# EasyEDA Pro project KVM Assistant.eprj

# Schematic 3.5mm Input Connector
Board Name: 3.5mm Input Connector; Create Date: 2025-04-06; Page Name: P1; Project Name: KVM Assistant 3; Schematic Name: 3.5mm Input Connector; Update Date: 2025-04-06; Company: EasyEDA.com; Page Size: A4; Version: V1.0
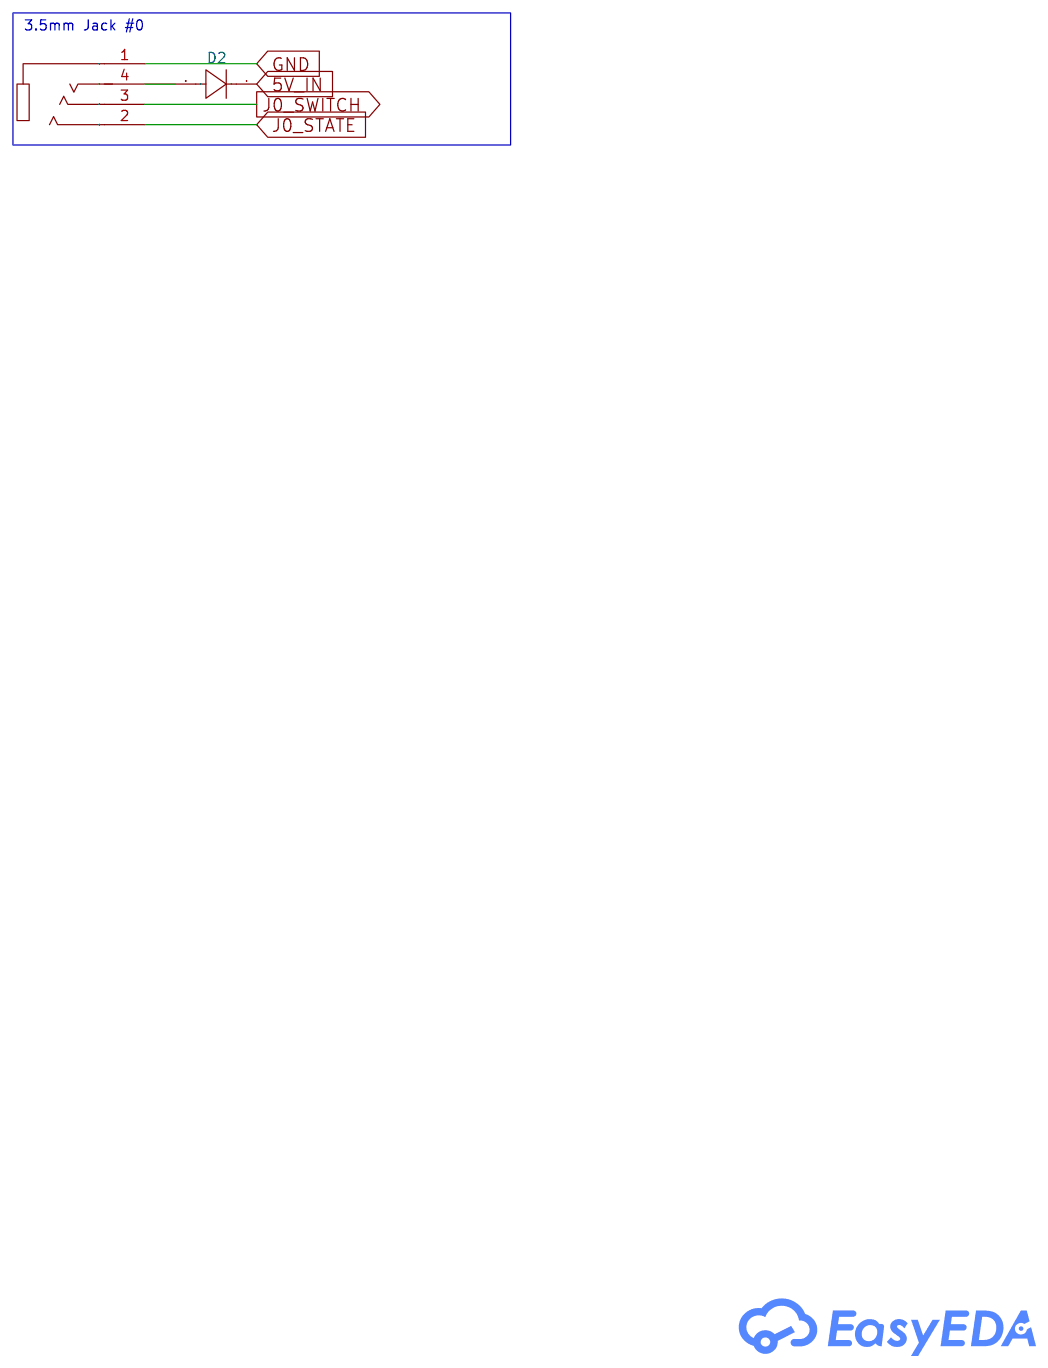
[diagram p0: schematic sheet]

## Parts
3.5mm  PJ-320D  [AUDIO-SMD_PJ-320D]
D2  -  [DO-41_BD2.4-L4.7-P8.70-D0.9-RD]

## Library data of the parts
3.5mm = PJ-320D_C431535: Connector Type:3.5mm Headphone Jack Current Rating (Max):500mA Voltage Rating (Max):50V Contact Material:Copper Contact Plating:Silver Operating Temperature Range:-30℃~+70℃ Operating Temperature Range:-30℃~+70℃; LCSC Part Name: 3.5mm耳机座; Supplier Part: C431535; Manufacturer: SHOU HAN(首韩); Supplier Footprint: SMD; JLCPCB Part Class: Extended Part; Datasheet: https://atta.szlcsc.com/upload/public/pdf/source/20190925/C431535_8B274506621F6117FB020BF07A197848.pdf; Supplier: LCSC; Connector Type: 3.5mm Headphone Jack; Current Rating (Max): 500mA; Voltage Rating (Max): 50V; Contact Material: Copper; Contact Plating: Silver; Operating Temperature Range: -30℃~+70℃; INPUT_NUMBER: 1
D2 = 1N4007: Supplier Footprint: DO-41; INPUT_NUMBER: 1

## Nets
5V_IN: D2.1(K)
GND: 3.5mm.1
J0_STATE: 3.5mm.2
J0_SWITCH: 3.5mm.3
Net-(3.5mm-4): 3.5mm.4 D2.2(A)

## Notes on the sheet
- 3.5mm Jack #0

# Schematic inputs

## Sheets
1 inputs: Board Name: Board1; Create Date: 2025-04-06; Page Name: inputs; Project Name: KVM Assistant 3; Schematic Name: inputs; Update Date: 2025-04-06; File: inputs; Id: /; Sheet: /
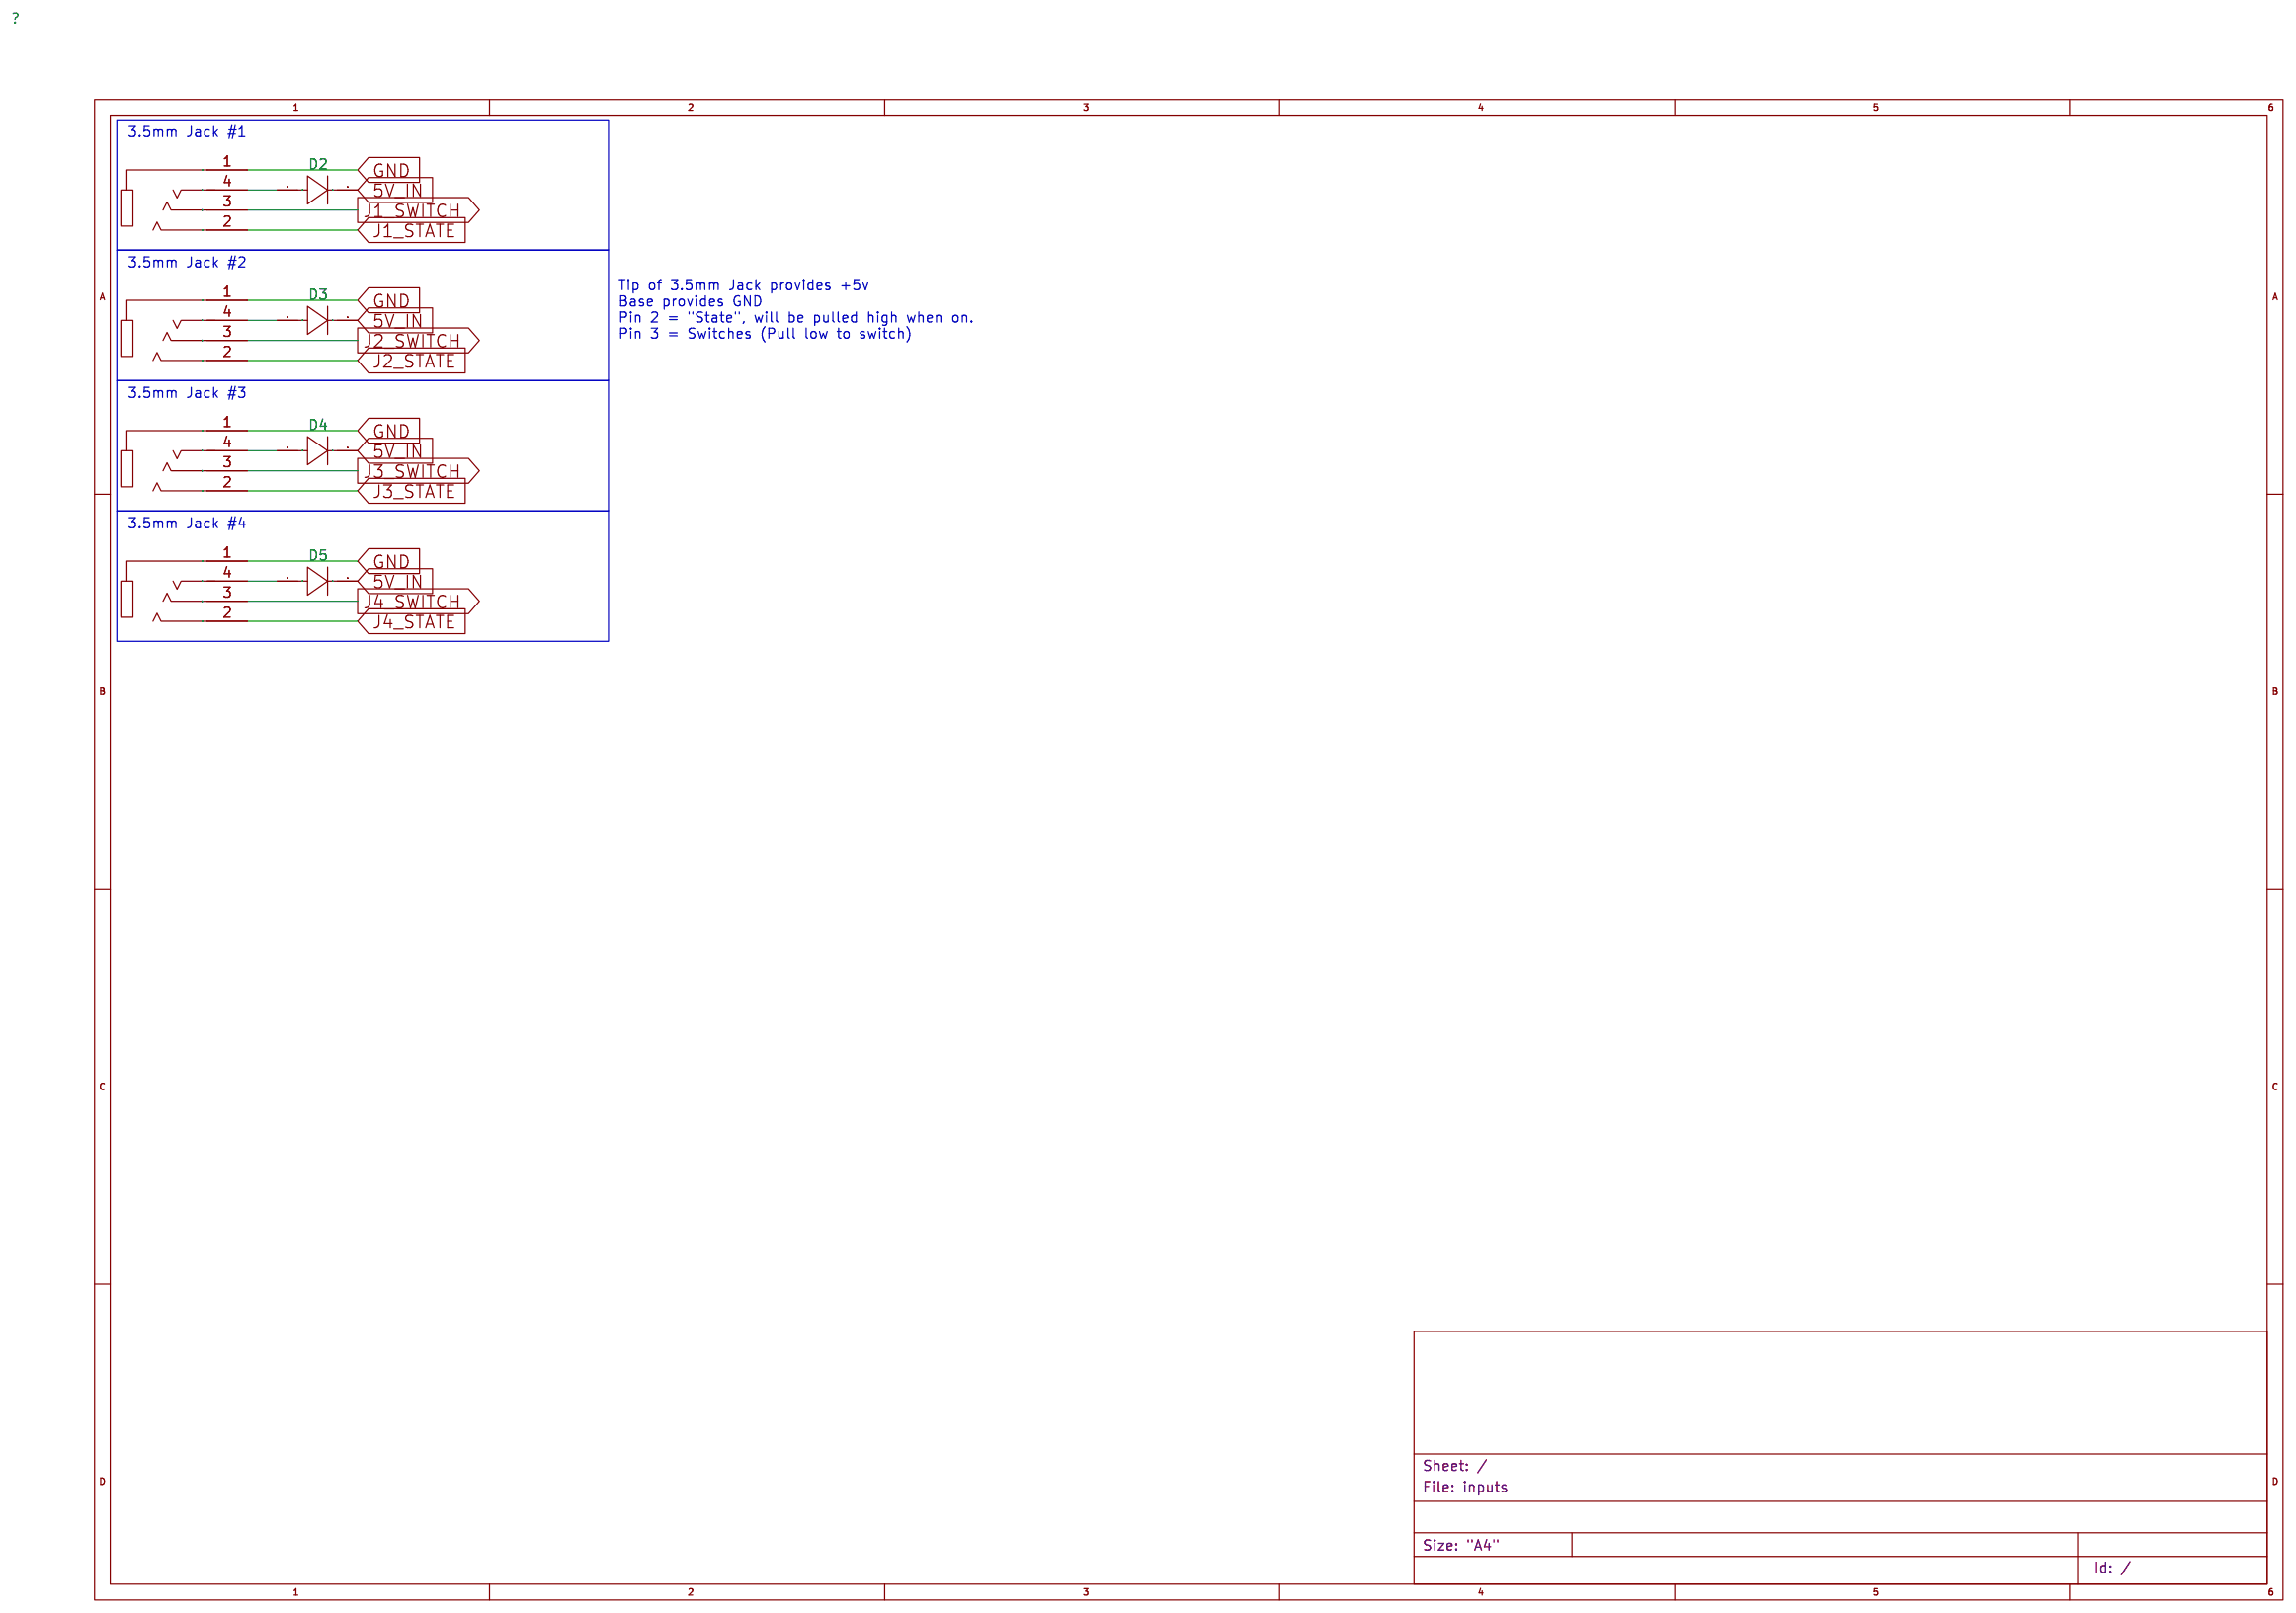
[diagram p1: inputs]
2 logic: Page Name: logic; File: logic
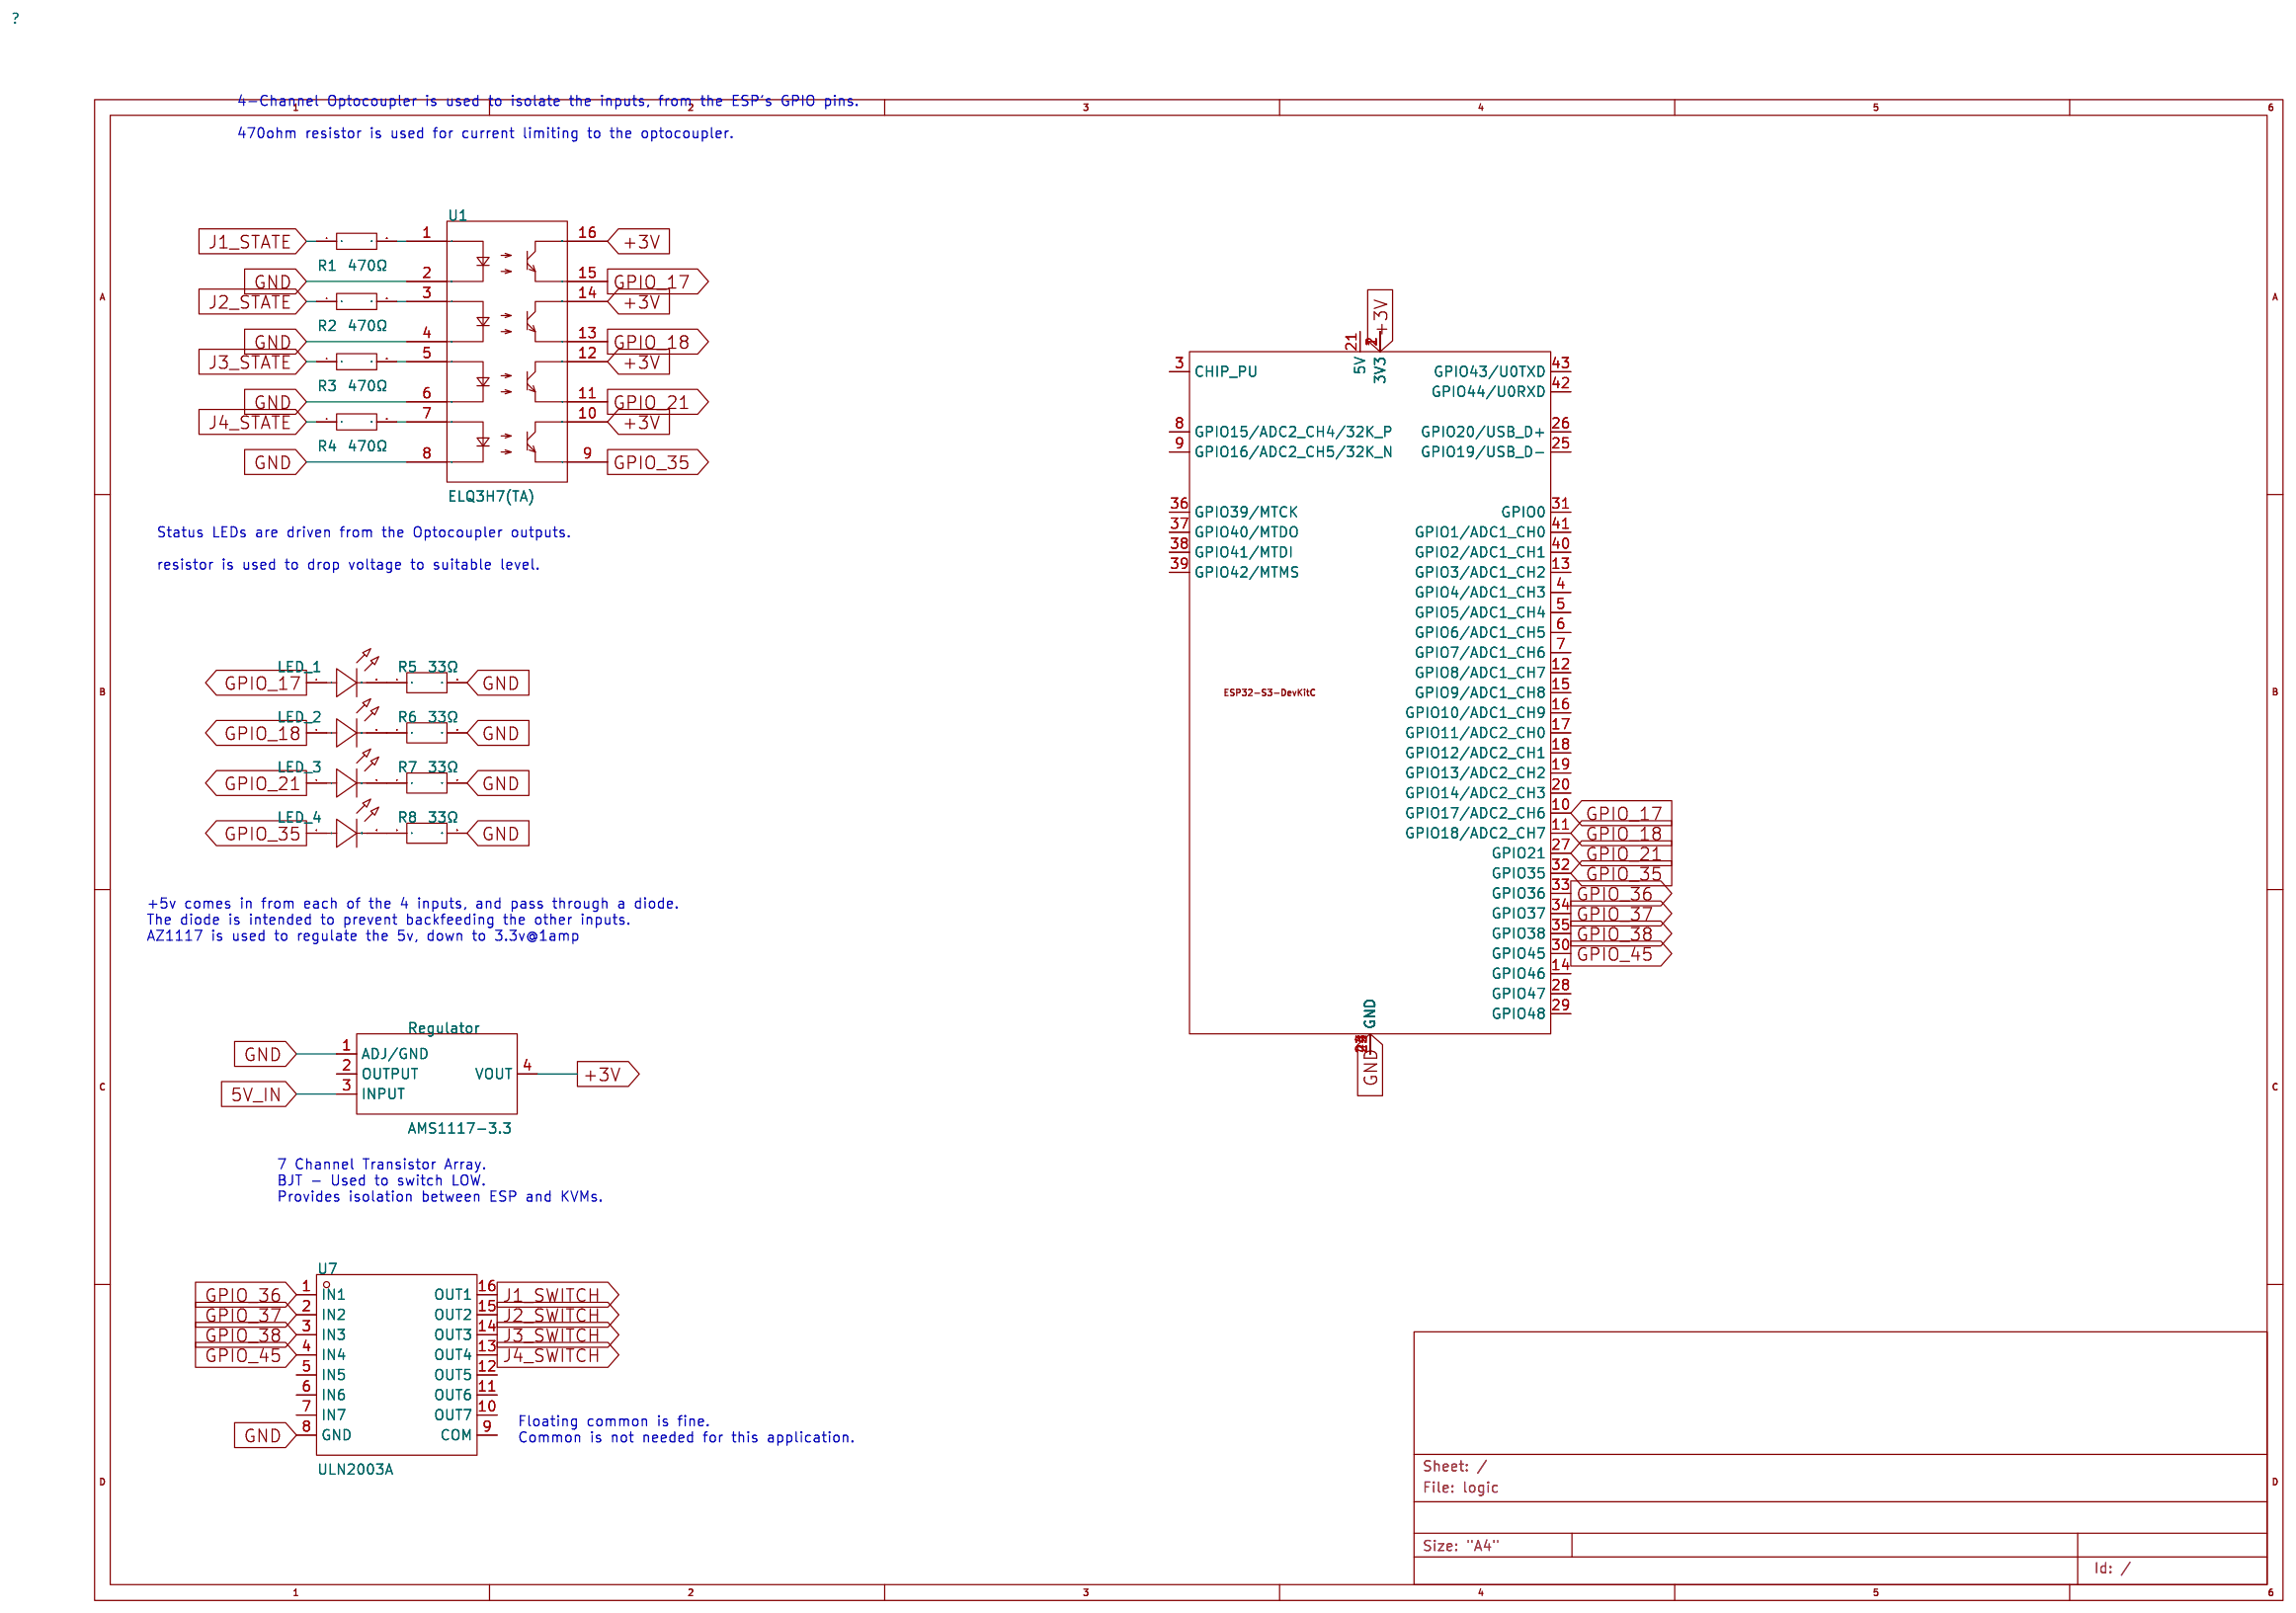
[diagram p2: logic]

## Parts
sheet inputs
3.5mm1  PJ-320D  [AUDIO-SMD_PJ-320D]
3.5mm2  PJ-320D  [AUDIO-SMD_PJ-320D]
3.5mm3  PJ-320D  [AUDIO-SMD_PJ-320D]
3.5mm4  PJ-320D  [AUDIO-SMD_PJ-320D]
D2  -  [DO-41_BD2.4-L4.7-P8.70-D0.9-RD]
D3  -  [DO-41_BD2.4-L4.7-P8.70-D0.9-RD]
D4  -  [DO-41_BD2.4-L4.7-P8.70-D0.9-RD]
D5  -  [DO-41_BD2.4-L4.7-P8.70-D0.9-RD]
sheet logic
ESP  ESP32-S3-DevKitC  [PCM_Espressif:ESP32-S3-DevKitC]
LED_1  DY-332SUGD-A3  [LED-TH_BD5.9-P2.54-FD]
LED_2  DY-332SUGD-A3  [LED-TH_BD5.9-P2.54-FD]
LED_3  DY-332SUGD-A3  [LED-TH_BD5.9-P2.54-FD]
LED_4  DY-332SUGD-A3  [LED-TH_BD5.9-P2.54-FD]
R1  470Ω  [R1206]
R2  470Ω  [R1206]
R3  470Ω  [R1206]
R4  470Ω  [R1206]
R5  33Ω  [R1206]
R6  33Ω  [R1206]
R7  33Ω  [R1206]
R8  33Ω  [R1206]
Regulator  AMS1117-3.3  [SOT-223-3_L6.5-W3.4-P2.30-LS7.0-BR]
U1  ELQ3H7(TA)  [SOP-16_L10.3-W4.4-P1.27-LS7.0-BL]
U7  ULN2003A  [DIP-16_L20.0-W6.4-P2.54-LS7.6-BL]

## Library data of the parts
3.5mm1-3.5mm4 = PJ-320D_C431535: Connector Type:3.5mm Headphone Jack Current Rating (Max):500mA Voltage Rating (Max):50V Contact Material:Copper Contact Plating:Silver Operating Temperature Range:-30℃~+70℃ Operating Temperature Range:-30℃~+70℃; LCSC Part Name: 3.5mm耳机座; Supplier Part: C431535; Manufacturer: SHOU HAN(首韩); Supplier Footprint: SMD; JLCPCB Part Class: Extended Part; Datasheet: https://atta.szlcsc.com/upload/public/pdf/source/20190925/C431535_8B274506621F6117FB020BF07A197848.pdf; Supplier: LCSC; Connector Type: 3.5mm Headphone Jack; Current Rating (Max): 500mA; Voltage Rating (Max): 50V; Contact Material: Copper; Contact Plating: Silver; Operating Temperature Range: -30℃~+70℃; INPUT_NUMBER: 1
D2-D5 = 1N4007: Supplier Footprint: DO-41; INPUT_NUMBER: 1
ESP = PCM_Espressif_ESP32-S3-DevKitC
LED_1-LED_4 = DY-332SUGD-A3: LCSC Part Name: 5mm圆头有边翠绿色; Supplier Part: C7470788; Manufacturer: TONYU(东裕); Supplier Footprint: D=5mm; JLCPCB Part Class: Extended Part; Datasheet: https://atta.szlcsc.com/upload/public/pdf/source/20230726/AA93B767F39ACAA896428125483B3D95.pdf; Supplier: LCSC
R1-R4 = 1206W4F4700T5E: Type:Thick Film Resistors Resistance: Tolerance:±1% Tolerance:±1% Power(Watts): Overload Voltage (Max): Temperature Coefficient:±100ppm/℃ Temperature Coefficient:±100ppm/℃ Operating Temperature Range:-55℃~+155℃ Operating Temperature Range:-55℃~+155℃; LCSC Part Name: 470Ω ±1% 250mW 厚膜电阻; Supplier Part: C4502; Manufacturer: UNI-ROYAL(厚声); Supplier Footprint: 1206; JLCPCB Part Class: Extended Part; Datasheet: https://atta.szlcsc.com/upload/public/pdf/source/20200306/C422600_1E6D84923E4A46A82E41ADD87F860B5C.pdf; Supplier: LCSC; Type: Thick Film Resistors; Tolerance: ±1%; Temperature Coefficient: ±100ppm/℃; Operating Temperature Range: -55℃~+155℃
R5-R8 = FRC1206F33R0TS: Type:Thick Film Resistors Resistance: Tolerance:±1% Tolerance:±1% Power(Watts): Overload Voltage (Max): Temperature Coefficient:±100ppm/℃ Temperature Coefficient:±100ppm/℃ Operating Temperature Range:-55℃~+155℃ Operating Temperature Range:-55℃~+155℃; LCSC Part Name: 33Ω ±1% 250mW 厚膜电阻; Supplier Part: C2907384; Manufacturer: FOJAN(富捷); Supplier Footprint: 1206; JLCPCB Part Class: Extended Part; Datasheet: https://atta.szlcsc.com/upload/public/pdf/source/20211221/925EC7D7225764EE0046F22065062C87.pdf; Supplier: LCSC; Type: Thick Film Resistors; Tolerance: ±1%; Temperature Coefficient: ±100ppm/℃; Operating Temperature Range: -55℃~+155℃
Regulator = AMS1117-3.3_C18212698: Output Type:Fixed Voltage - Supply:18V Output Voltage:3.3V Output Voltage:3.3V Output Current:1A Power Supply Rejection Ratio (PSRR):- Voltage Dropout:- standby current:- Noise:- Features:- Operating Temperature:- Operating Temperature:- Output Configurat; Supplier Part: C18212698; Manufacturer: TECH PUBLIC(台舟); Supplier Footprint: SOT-223; JLCPCB Part Class: Extended Part; Datasheet: https://atta.szlcsc.com/upload/public/pdf/source/20231024/2F46361C191D0B74404CBB3E85314756.pdf; Supplier: LCSC; Output Type: Fixed; Voltage - Supply: 18V; Output Voltage: 3.3V; Output Current: 1A; Maximum Input Voltage: 13V; MAX Output Current: 1A; Dropout Voltage: 1.3V@(1A); Output Polarity: Positive electrode
U1 = ELQ3H7(TA): Input voltage type:DC Output Type:Phototransistor Forward Voltage:1.2V Output Current:50mA Isolation Voltage(rms):3.75kV Reverse Voltage:6V Load Voltage:80V Number of Outputs:4 Collector-Emitter Saturation Voltage (Vce(sat)@Ic,IF):100mV@1mA,10mA Rise time; LCSC Part Name: DC输入 隔离电压(rms):3750V; Supplier Part: C146217; Manufacturer: EVERLIGHT(亿光); Supplier Footprint: SSOP-16-175mil-1.27mm; JLCPCB Part Class: Extended Part; Datasheet: https://atta.szlcsc.com/upload/public/pdf/source/20180606/C146217_115C5F924B3C17D372C30621DF807FC3.pdf; Supplier: LCSC; Input voltage type: DC; Output Type: Phototransistor; Forward Voltage: 1.2V; Output Current: 50mA; Isolation Voltage(rms): 3.75kV; Reverse Voltage: 6V; Load Voltage: 80V; Number of Outputs: 4; Collector-Emitter Saturation Voltage (Vce(sat)@Ic,IF): 100mV@1mA,10mA; Rise time: 5us@2mA,100Ω; Fall time: 3us@2mA,100Ω; Operating Temperature: -55℃~+110℃
U7 = ULN2003A_C93000: Supplier Part: C93000; Manufacturer: ST(意法半导体); Supplier Footprint: DIP-16; JLCPCB Part Class: Extended Part; Datasheet: https://atta.szlcsc.com/upload/public/pdf/source/20171116/C93000_15108227945891124497.pdf; Supplier: LCSC

## Nets
5V_IN: D2.1(K) D3.1(K) D4.1(K) D5.1(K) Regulator.3(INPUT)
+3V: ESP.1(3V3) ESP.2(3V3) Regulator.4(VOUT) U1.10(CO) U1.12(CO) U1.14(CO) U1.16(CO)
GND: 3.5mm1.1 3.5mm2.1 3.5mm3.1 3.5mm4.1 ESP.22(GND) ESP.23(GND) ESP.24(GND) ESP.44(GND) R5.2 R6.2 R7.2 R8.2 Regulator.1(ADJ/GND) U1.2(C) U1.4(C) U1.6(C) U1.8(C) U7.8(GND)
GPIO_17: ESP.10(GPIO17/ADC2_CH6) LED_1.1(A) U1.15(E)
GPIO_18: ESP.11(GPIO18/ADC2_CH7) LED_2.1(A) U1.13(E)
GPIO_21: ESP.27(GPIO21) LED_3.1(A) U1.11(E)
GPIO_35: ESP.32(GPIO35) LED_4.1(A) U1.9(E)
GPIO_36: ESP.33(GPIO36) U7.1(IN1)
GPIO_37: ESP.34(GPIO37) U7.2(IN2)
GPIO_38: ESP.35(GPIO38) U7.3(IN3)
GPIO_45: ESP.30(GPIO45) U7.4(IN4)
J1_STATE: 3.5mm1.2 R1.1
J1_SWITCH: 3.5mm1.3 U7.16(OUT1)
J2_STATE: 3.5mm2.2 R2.1
J2_SWITCH: 3.5mm2.3 U7.15(OUT2)
J3_STATE: 3.5mm3.2 R3.1
J3_SWITCH: 3.5mm3.3 U7.14(OUT3)
J4_STATE: 3.5mm4.2 R4.1
J4_SWITCH: 3.5mm4.3 U7.13(OUT4)
$1N2388: 3.5mm1.4 D2.2(A)
$1N2516: 3.5mm2.4 D3.2(A)
$1N2644: 3.5mm3.4 D4.2(A)
$1N2772: 3.5mm4.4 D5.2(A)
$2N30: R1.2 U1.1(A)
$2N1401: R2.2 U1.3(A)
$2N1405: R3.2 U1.5(A)
$2N1410: R4.2 U1.7(A)
$2N2325: LED_1.2(C) R5.1
$2N2327: LED_2.2(C) R6.1
$2N2329: LED_3.2(C) R7.1
$2N2331: LED_4.2(C) R8.1

Not connected (* = marked no-connect by the designer): ESP 3(CHIP_PU) 4(GPIO4/ADC1_CH3) 5(GPIO5/ADC1_CH4) 6(GPIO6/ADC1_CH5) 7(GPIO7/ADC1_CH6) 8(GPIO15/ADC2_CH4/32K_P) 9(GPIO16/ADC2_CH5/32K_N) 12(GPIO8/ADC1_CH7) 13(GPIO3/ADC1_CH2) 14(GPIO46) 15(GPIO9/ADC1_CH8) 16(GPIO10/ADC1_CH9) 17(GPIO11/ADC2_CH0) 18(GPIO12/ADC2_CH1) 19(GPIO13/ADC2_CH2) 20(GPIO14/ADC2_CH3) 21(5V) 25(GPIO19/USB_D-) 26(GPIO20/USB_D+) 28(GPIO47) 29(GPIO48) 31(GPIO0) 36(GPIO39/MTCK) 37(GPIO40/MTDO) 38(GPIO41/MTDI) 39(GPIO42/MTMS) 40(GPIO2/ADC1_CH1) 41(GPIO1/ADC1_CH0) 42(GPIO44/U0RXD) 43(GPIO43/U0TXD); Regulator 2(OUTPUT); U7 5(IN5) 6(IN6) 7(IN7) 9(COM) 10(OUT7) 11(OUT6) 12(OUT5)

## Notes on the sheets
sheet 1
- 3.5mm Jack #1
- 3.5mm Jack #2
- Tip of 3.5mm Jack provides +5v
  Base provides GND
  Pin 2 = "State", will be pulled high when on.
  Pin 3 = Switches (Pull low to switch)
- 3.5mm Jack #3
- 3.5mm Jack #4
sheet 2
- 4-Channel Optocoupler is used to isolate the inputs, from the ESP's GPIO pins.
  470ohm resistor is used for current limiting to the optocoupler.
- Status LEDs are driven from the Optocoupler outputs.
  resistor is used to drop voltage to suitable level.
- +5v comes in from each of the 4 inputs, and pass through a diode.
  The diode is intended to prevent backfeeding the other inputs.
  AZ1117 is used to regulate the 5v, down to 3.3v@1amp
- 7 Channel Transistor Array.
  BJT - Used to switch LOW.
  Provides isolation between ESP and KVMs.
- Floating common is fine.
  Common is not needed for this application.

# Board PCB
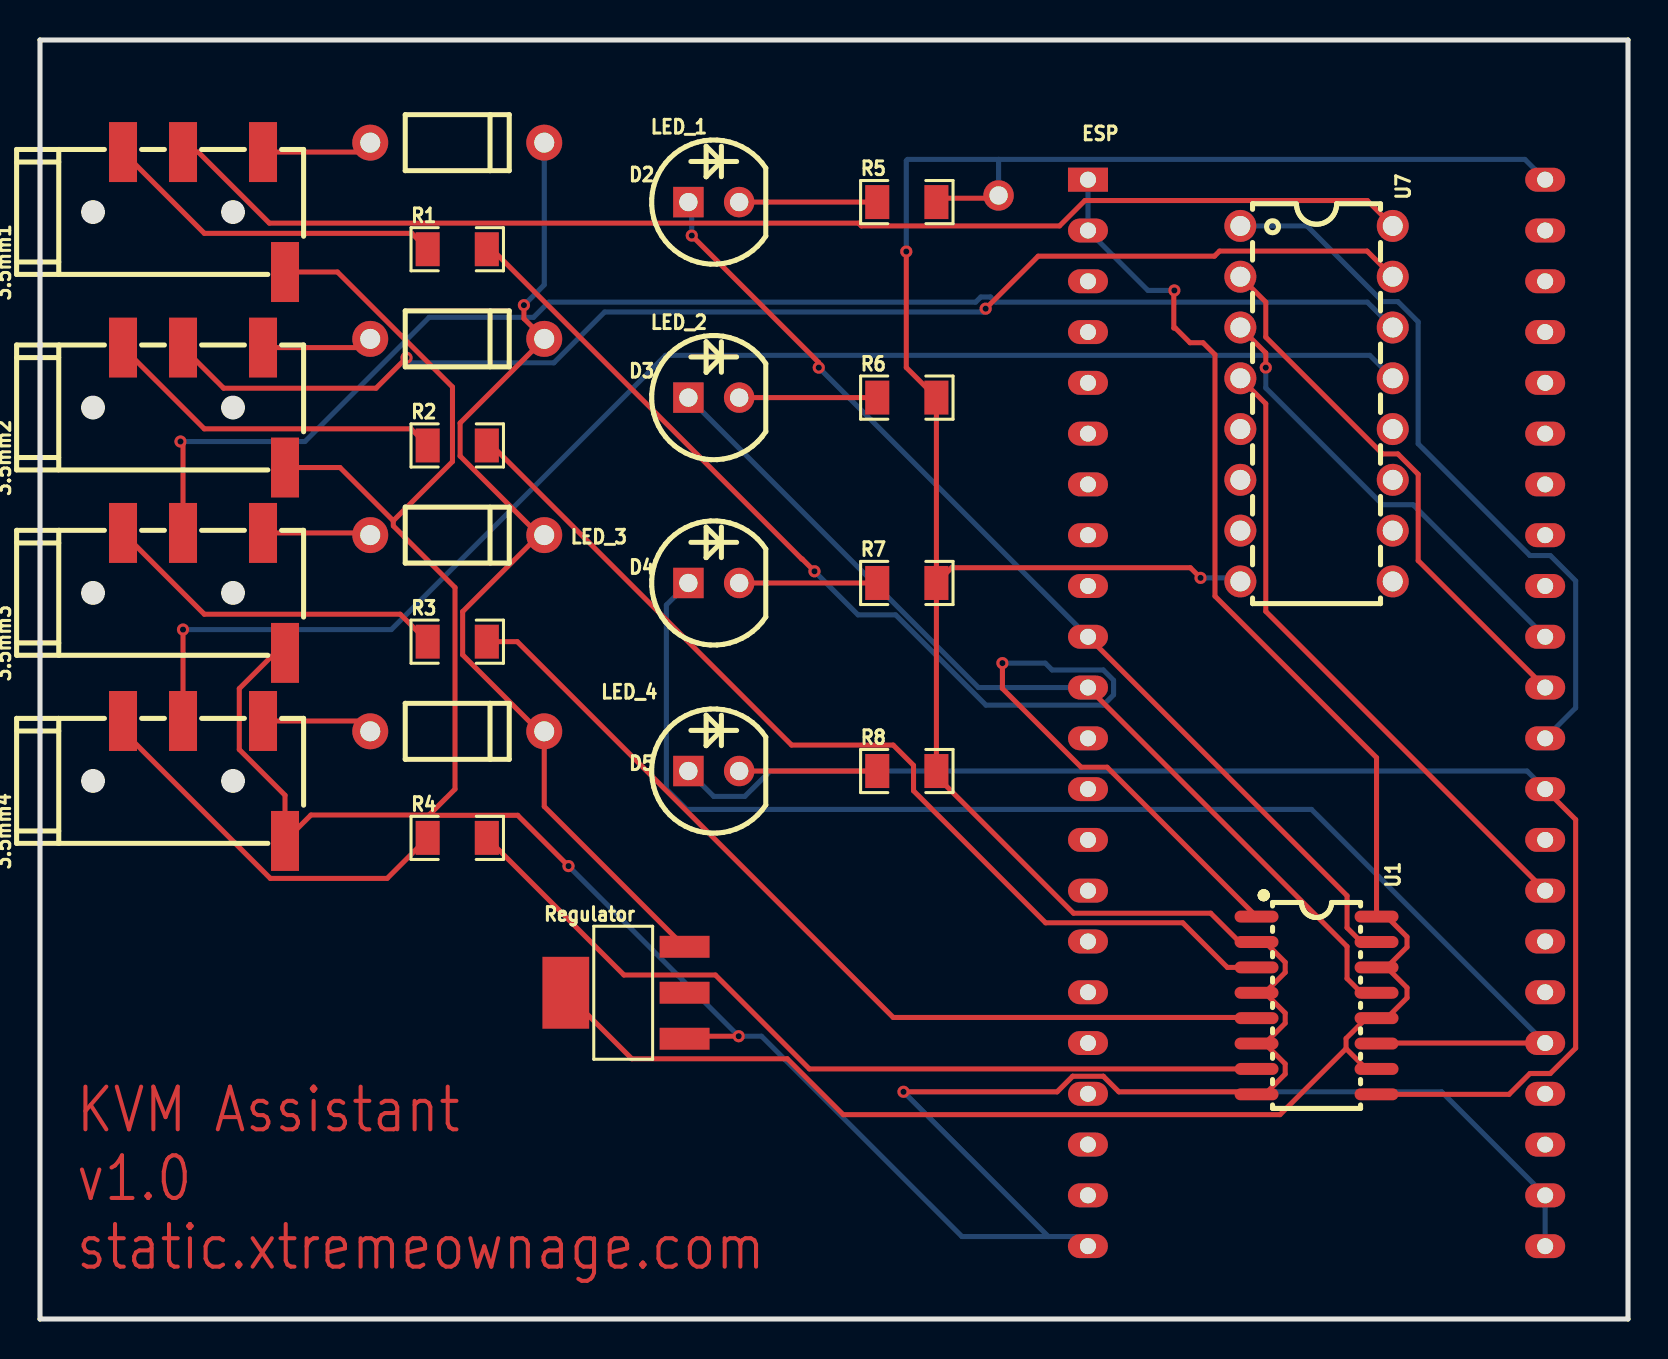
[diagram p3: board, top side]
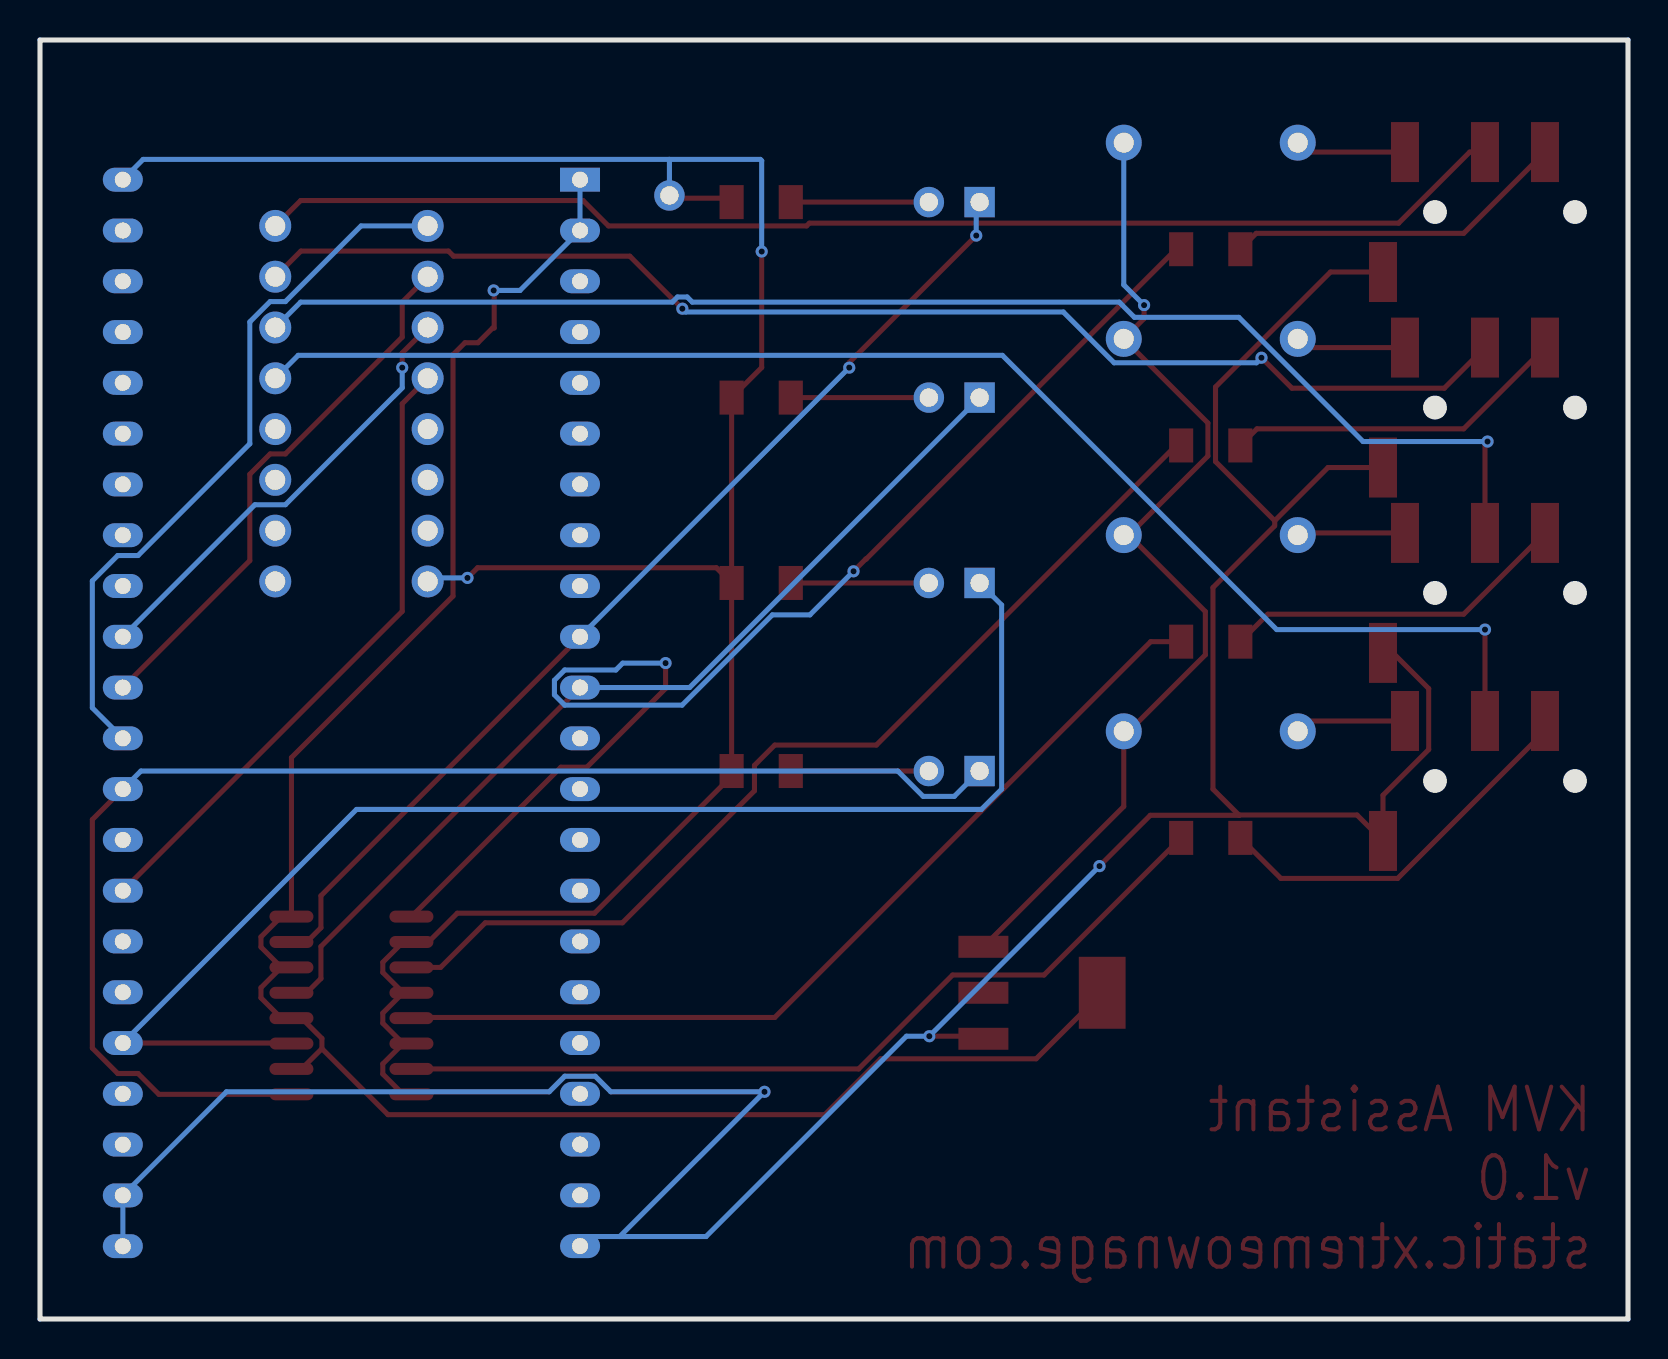
[diagram p4: board, bottom side, seen from below]

Outline 79.4 x 63.97 mm; copper layers: Top Layer, Bottom Layer. Coordinates in mm from the lower left corner of the outline.
Outline path: 0,63.97 79.4,63.97 79.4,0 0,0 0,63.97
Stack: Top Layer 0.035mm / Dielectric1 1.51mm FR4 er 4.5 / Bottom Layer 0.035mm

## Design rules (mm)
template: JLCPCB Capability(Two Layers Board)
spacing copperThickness1oz (default): track to track 0.102, other pairs 0.152 to 0.3
spacing copperThickness2oz: track to track 0.203, other pairs 0.152 to 0.3
track width copperThickness1oz (default): min 0.127, default 0.254, max 2.54
track width copperThickness2oz: min 0.203, default 0.254, max 2.54
differential pair differentialPair (default): width min 0.127, default 0.254, max 2.54; gap min 0.152, default 0.152
via viaSize (default): diameter min 0.5, default 0.61, max 10; hole min 0.3, default 0.305, max 6.3

## Placement (name value [footprint] x y rotation side)
3.5mm1  PJ-320D  [AUDIO-SMD_PJ-320D]  8.2 55.37 90 top
3.5mm2  PJ-320D  [AUDIO-SMD_PJ-320D]  8.2 45.59 90 top
3.5mm3  PJ-320D  [AUDIO-SMD_PJ-320D]  8.2 36.32 90 top
3.5mm4  PJ-320D  [AUDIO-SMD_PJ-320D]  8.2 26.91 90 top
D2  1N4007  [DO-41_BD2.4-L4.7-P8.70-D0.9-RD]  20.86 58.84 180 top
D3  1N4007  [DO-41_BD2.4-L4.7-P8.70-D0.9-RD]  20.86 49.02 180 top
D4  1N4007  [DO-41_BD2.4-L4.7-P8.70-D0.9-RD]  20.86 39.21 180 top
D5  1N4007  [DO-41_BD2.4-L4.7-P8.70-D0.9-RD]  20.86 29.39 180 top
ESP  ESP32-S3-DevKitC  [PCM_Espressif:ESP32-S3-DevKitC]  52.4 56.98 0 top
LED_1  DY-332SUGD-A3  [LED-TH_BD5.9-P2.54-FD]  33.69 55.86 0 top
LED_2  DY-332SUGD-A3  [LED-TH_BD5.9-P2.54-FD]  33.69 46.09 0 top
LED_3  DY-332SUGD-A3  [LED-TH_BD5.9-P2.54-FD]  33.69 36.81 0 top
LED_4  DY-332SUGD-A3  [LED-TH_BD5.9-P2.54-FD]  33.69 27.41 0 top
NOREF  -  [Pad_e2032]  47.93 56.2 0 top
R1  470Ω  [R1206]  20.86 53.51 0 top
R2  470Ω  [R1206]  20.86 43.69 0 top
R3  470Ω  [R1206]  20.86 33.88 0 top
R4  470Ω  [R1206]  20.86 24.06 0 top
R5  33Ω  [R1206]  43.34 55.86 0 top
R6  33Ω  [R1206]  43.34 46.09 0 top
R7  33Ω  [R1206]  43.34 36.81 0 top
R8  33Ω  [R1206]  43.34 27.41 0 top
Regulator  AMS1117-3.3  [SOT-223-3_L6.5-W3.4-P2.30-LS7.0-BR]  29.26 16.32 0 top
U1  ELQ3H7(TA)  [SOP-16_L10.3-W4.4-P1.27-LS7.0-BL]  63.83 15.68 270 top
U7  ULN2003A  [DIP-16_L20.0-W6.4-P2.54-LS7.6-BL]  63.83 45.78 270 top

## Footprints (pads in the part's own frame, mm; a bottom-side part is the same pattern mirrored in y, then rotated)
AUDIO-SMD_PJ-320D
  rect 3x1.4 smd: 1(-3,-4.05) 2(3,4.05) 3(3,1.05) 4(3,-2.95)
DIP-16_L20.0-W6.4-P2.54-LS7.6-BL
  round 1.6 hole 1: 1(-8.89,-3.81) 2(-6.35,-3.81) 3(-3.81,-3.81) 4(-1.27,-3.81) 5(1.27,-3.81) 6(3.81,-3.81) 7(6.35,-3.81) 8(8.89,-3.81) 9(8.89,3.81) 10(6.35,3.81) 11(3.81,3.81) 12(1.27,3.81) 13(-1.27,3.81) 14(-3.81,3.81) 15(-6.35,3.81) 16(-8.89,3.81)
DO-41_BD2.4-L4.7-P8.70-D0.9-RD
  round 1.8 hole 1: 1(-4.35,0) 2(4.35,0)
LED-TH_BD5.9-P2.54-FD
  rect 1.524x1.524 hole 0.914: 1(-1.27,0)
  round 1.524 hole 0.914: 2(1.27,0)
Pad_e2032
  round 1.524 hole 0.914: 1(0,0)
PCM_Espressif:ESP32-S3-DevKitC
  rect 2x1.2 hole 0.8: 1(0,0)
  oval 2x1.2 hole 0.8: 2(0,-2.54) 3(0,-5.08) 4(0,-7.62) 5(0,-10.16) 6(0,-12.7) 7(0,-15.24) 8(0,-17.78) 9(0,-20.32) 10(0,-22.86) 11(0,-25.4) 12(0,-27.94) 13(0,-30.48) 14(0,-33.02) 15(0,-35.56) 16(0,-38.1) 17(0,-40.64) 18(0,-43.18) 19(0,-45.72) 20(-0.004,-48.258) 21(-0.004,-50.797) 22(-0.004,-53.337) 23(22.86,-53.34) 24(22.86,-50.8) 25(22.86,-48.26) 26(22.86,-45.72) 27(22.86,-43.18) 28(22.86,-40.64) 29(22.86,-38.1) 30(22.86,-35.56) 31(22.86,-33.02) 32(22.86,-30.48) 33(22.86,-27.94) 34(22.86,-25.4) 35(22.86,-22.86) 36(22.86,-20.32) 37(22.86,-17.78) 38(22.86,-15.24) 39(22.86,-12.7) 40(22.86,-10.16) 41(22.86,-7.62) 42(22.86,-5.08) 43(22.86,-2.54) 44(22.86,0)
R1206
  rect 1.208x1.701 smd: 1(-1.479,0) 2(1.479,0)
SOP-16_L10.3-W4.4-P1.27-LS7.0-BL
  oval 0.6x2.2 smd: 1(-4.445,-3) 2(-3.175,-3) 3(-1.905,-3) 4(-0.635,-3) 5(0.635,-3) 6(1.905,-3) 7(3.175,-3) 8(4.445,-3) 9(4.445,3) 10(3.175,3) 11(1.905,3) 12(0.635,3) 13(-0.635,3) 14(-1.905,3) 15(-3.175,3) 16(-4.445,3)
SOT-223-3_L6.5-W3.4-P2.30-LS7.0-BR
  rect 2.5x1.1 smd: 1(2.97,-2.3) 2(2.97,0) 3(2.97,2.3)
  rect 2.34x3.6 smd: 4(-2.97,0)

## Nets
As in the schematic, except:
GND: 3.5mm1.1 3.5mm2.1 3.5mm3.1 3.5mm4.1 ESP.22 ESP.23 ESP.24 ESP.44 NOREF.1 R5.2 R6.2 R7.2 R8.2 Regulator.1 U1.2 U1.4 U1.6 U1.8 U7.8

Pads without a net: ESP 3 4 5 6 7 8 9 12 13 14 15 16 17 18 19 20 21 25 26 28 29 31 36 37 38 39 40 41 42 43; Regulator 2; U7 5 6 7 9 10 11 12

## Via types
v1: diameter 0.61, hole 0.305, Top Layer to Bottom Layer, 16 vias

## Routing (per net, layer and track width the routed paths; a pad name or vN(x,y) marks a point on that pad's centre or on a via; arc(x,y) is an arc through that point)
5V_IN: length 51
  Top Layer w0.254: Regulator.3 25.21,25.64 D5.1 24.96,29.39 21.13,33.22 21.13,35.38 24.96,39.21 ; 24.96,39.21 21.01,43.16 21.01,44.81 D3.1 24.2,50.04 v1(24.2,50.71) ; 24.96,39.21 D4.1
  Bottom Layer w0.254: D2.1 25.21,51.73 v1(24.2,50.71)
+3V: length 99.6
  Top Layer w0.254: 65.31,13.52 65.31,14.03 66.32,15.05 U1.12 67.34,15.05 68.35,16.06 68.35,16.57 67.34,17.59 ; 65.31,13.52 62,10.22 40.16,10.22 37.37,13.02 29.59,13.02 Regulator.4 ; 65.31,13.52 66.32,12.51 U1.10 ; 67.34,17.59 68.35,18.6 68.35,19.11 67.34,20.13 U1.16 66.83,28.08 58.75,36.16 58.75,48.23 58.15,48.83 57.5,48.83 56.77,49.57 56.69,49.57 56.69,51.42 v1(56.72,51.45) ; 67.34,17.59 U1.14
  Bottom Layer w0.254: v1(56.72,51.45) 55.4,51.45 ESP.2 ESP.1
GND: length 287.6
  Top Layer w0.254: v1(43.18,11.36) 50.86,11.36 51.64,12.14 53.17,12.14 53.94,11.36 60.7,11.36 U1.8 61.25,11.24 62.26,12.25 62.26,12.76 61.25,13.78 ; 17.66,39.93 20.62,42.89 20.62,46.62 14.87,52.37 3.5mm1.1 ; 17.66,39.93 15,42.59 3.5mm2.1 ; 17.66,39.93 17.66,39.67 ; v1(26.43,22.65) 23.89,25.19 19.44,25.19 ; v1(58.03,37.07) 57.52,37.58 45.58,37.58 R7.2 ; 17.69,39.64 20.75,36.58 20.75,26.5 19.44,25.19 ; 3.5mm3.1 12.24,33.31 11.74,33.31 9.97,31.53 9.97,28.48 12.25,26.2 3.5mm4.1 13.55,25.21 19.43,25.21 19.44,25.19 ; 61.25,16.32 U1.4 ; 61.25,16.32 62.26,15.3 62.26,14.79 61.25,13.78 ; 61.25,16.32 62.26,17.33 62.26,17.84 61.25,18.86 U1.2 59.98,18.86 58.54,20.3 51.68,20.3 44.82,27.15 R8.2 R7.2 ; R7.2 R6.2 43.32,47.59 v1(43.32,53.39) ; 61.25,13.78 U1.6 ; 47.63,56.06 45.02,56.06 R5.2 ; 32.23,14.02 32.36,14.14 v1(34.94,14.14)
  Bottom Layer w0.254: NOREF.1 47.93,57.98 47.95,58 ; v1(26.43,22.65) v1(34.94,14.14) 36.08,14.14 46.1,4.13 50.42,4.13 ; 50.42,4.13 52.45,4.13 52.45,3.7 ESP.22 ; 50.42,4.13 v1(43.18,11.36) 50.86,11.36 51.64,12.14 53.17,12.14 53.94,11.36 70.08,11.36 ESP.24 75.26,3.64 ; v1(43.32,53.39) 43.32,57.93 43.38,58 47.95,58 ; 47.95,58 74.24,58 ESP.44 ; v1(58.03,37.07) 59.84,37.07 U7.8
GPIO_17: length 51.7
  Top Layer w0.254: U1.15 66.07,18.86 65.36,19.57 65.36,21.17 ESP.10 ; v1(38.94,47.59) 38.94,47.84 v1(32.59,54.19)
  Bottom Layer w0.254: ESP.10 v1(38.94,47.59) ; LED_1.1 32.59,55.69 v1(32.59,54.19)
GPIO_18: length 47.7
  Top Layer w0.254: ESP.11 65.36,18.63 65.36,17.03 66.07,16.32 U1.13
  Bottom Layer w0.254: LED_2.1 46.92,31.58 ESP.11
GPIO_21: length 68.4
  Top Layer w0.254: ESP.27 66.86,13.8 U1.11
  Bottom Layer w0.254: ESP.27 63.58,25.49 32.33,25.49 31.32,26.5 31.32,35.71 LED_3.1
GPIO_35: length 68.8
  Top Layer w0.254: U1.9 73.46,11.24 74.5,12.28 75.52,12.28 76.79,13.55 76.79,24.98 ESP.32
  Bottom Layer w0.254: LED_4.1 33.69,26.14 35.24,26.14 36.51,27.41 74.36,27.41 ESP.32
GPIO_36: length 36.2
  Bottom Layer w0.254: ESP.33 76.79,30.57 76.79,36.92 75.52,38.19 74.5,38.19 68.91,43.78 68.91,49.87 67.89,50.89 67.13,50.89 63.35,54.67 U7.1
GPIO_37: length 27.3
  Top Layer w0.254: ESP.34 68.91,37.93 68.91,42.25 67.89,43.27 67.13,43.27 61.29,49.11 61.29,50.86 U7.2
GPIO_38: length 22.7
  Top Layer w0.254: U7.3 61.29,48.32 v1(61.29,47.59)
  Bottom Layer w0.254: v1(61.29,47.59) 61.29,46.57 67.13,40.73 68.66,40.73 ESP.35
GPIO_45: length 31.9
  Top Layer w0.254: U7.4 61.29,45.78 61.29,35.39 ESP.30
J1_STATE: length 17.2
  Top Layer w0.254: 19.38,53.51 18.59,54.3 8.22,54.3 3.5mm1.2
J1_SWITCH: length 63.1
  Top Layer w0.254: U7.16 66.37,55.94 52.25,55.94 50.98,54.67 41.07,54.67 40.93,54.81 11.47,54.81 7.91,58.37 3.5mm1.3
J2_STATE: length 17.3
  Top Layer w0.254: 19.38,43.69 18.55,44.52 8.22,44.52 3.5mm2.2
J2_SWITCH: length 64.9
  Top Layer w0.254: U7.15 66.36,53.41 58.98,53.41 58.73,53.16 49.91,53.16 v1(47.28,50.53) ; 3.5mm2.3 9.18,46.56 16.8,46.56 v1(18.33,48.08)
  Bottom Layer w0.254: v1(47.28,50.53) 47.12,50.37 28.23,50.37 25.69,47.83 18.58,47.83 v1(18.33,48.08)
J3_STATE: length 17.5
  Top Layer w0.254: 3.5mm3.2 8.22,35.25 18.01,35.25 19.38,33.88
J3_SWITCH: length 68.9
  Top Layer w0.254: v1(7.02,43.89) 7.15,43.76 3.5mm3.3
  Bottom Layer w0.254: v1(7.02,43.89) 13.25,43.89 19.46,50.1 24.68,50.1 25.44,50.86 46.79,50.86 47.04,51.12 47.53,51.12 47.78,50.86 66.37,50.86 U7.14
J4_STATE: length 19.6
  Top Layer w0.254: 3.5mm4.2 4.15,29.4 11.52,22.04 17.36,22.04 19.38,24.06
J4_SWITCH: length 71.2
  Top Layer w0.254: 3.5mm4.3 v1(7.15,34.48)
  Bottom Layer w0.254: v1(7.15,34.48) 17.56,34.48 31.28,48.2 66.49,48.2 U7.13
$1N2388: length 5.6
  Top Layer w0.254: 3.5mm1.4 16.04,58.37 D2.2
$1N2516: length 5.5
  Top Layer w0.254: 3.5mm2.4 16.08,48.59 D3.2
$1N2644: length 5.4
  Top Layer w0.254: 3.5mm3.4 16.41,39.32 D4.2
$1N2772: length 5.6
  Top Layer w0.254: 3.5mm4.4 16,29.91 D5.2
$2N30: length 66.3
  Top Layer w0.254: v1(38.73,37.4) 38.11,38.01 38.09,38.01 22.6,53.51 R1.2 ; v1(48.12,32.81) 48.12,31.54 52.06,27.6 53.36,27.6 U1.1
  Bottom Layer w0.254: v1(38.73,37.4) 40.9,35.22 42.78,35.22 47.3,30.7 53.17,30.7 53.68,31.22 53.68,31.95 53.17,32.46 50.61,32.46 50.26,32.81 v1(48.12,32.81)
$2N1401: length 50
  Top Layer w0.254: R2.2 22.6,43.69 37.58,28.71 42.66,28.71 43.68,27.69 43.68,26.42 50.28,19.82 57.14,19.82 59.37,17.59 U1.3
$2N1405: length 46.3
  Top Layer w0.254: U1.5 60.8,15.08 42.66,15.08 23.87,33.88 R3.2
$2N1410: length 43.3
  Top Layer w0.254: U1.7 38.47,12.51 33.77,17.21 29.2,17.21 R4.2
$2N2325: length 6.9
  Top Layer w0.254: R5.1 LED_1.2
$2N2327: length 6.9
  Top Layer w0.254: R6.1 LED_2.2
$2N2329: length 6.9
  Top Layer w0.254: R7.1 LED_3.2
$2N2331: length 6.9
  Top Layer w0.254: R8.1 LED_4.2

## Text on the board
Top Layer: KVM Assistant / v1.0 / static.xtremeownage.com
